# Altium schematic sheet FilterBlock.SchDoc
size A4
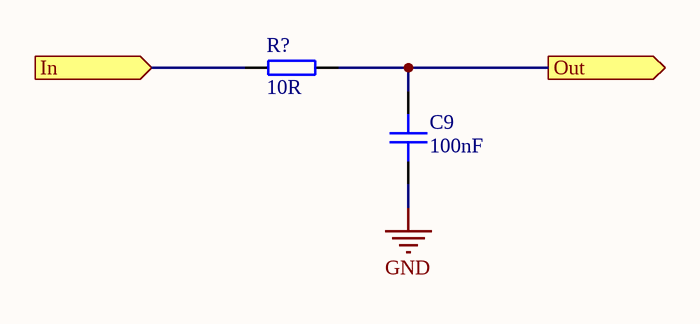
[diagram p0: FilterBlock.SchDoc]

## Parts
C9  100nF  [CAP 0603]
R?  10R  [0603]

## Ports
In (in), Out (out)

## Nets
GND: C9.1
In: R?.1 ; port In
Out: C9.2 R?.2 ; port Out

## Library data of the parts
C9 = 5: ID: 5; Value: 100nF; Mounting: SMT; Package: 0603
R? = 219: ID: 219; Tolerance: 1%; Power Rating: 0.1W; Value: 10R; Mounting: SMD; Type: Chip; Package: 0603